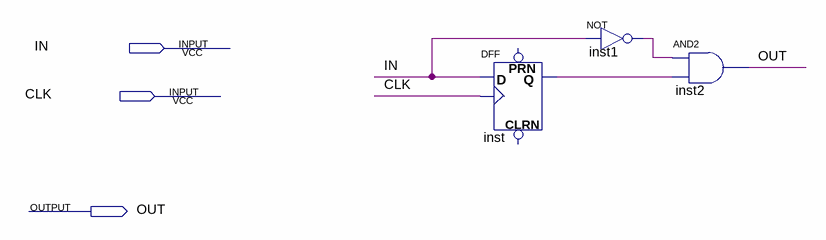
[diagram p0: schematic sheet]
// Quartus schematic FallingEdge.bdf as structural Verilog: 3 symbols, 3 pins
module FallingEdge (
  input  IN,
  input  CLK,
  output OUT
);

  wire inst1_out, inst_q;

  DFF inst (.CLK(CLK), .D(IN), .Q(inst_q));  // open: CLRN, PRN
  not inst1 (inst1_out, IN);
  and inst2 (OUT, inst1_out, inst_q);
endmodule
